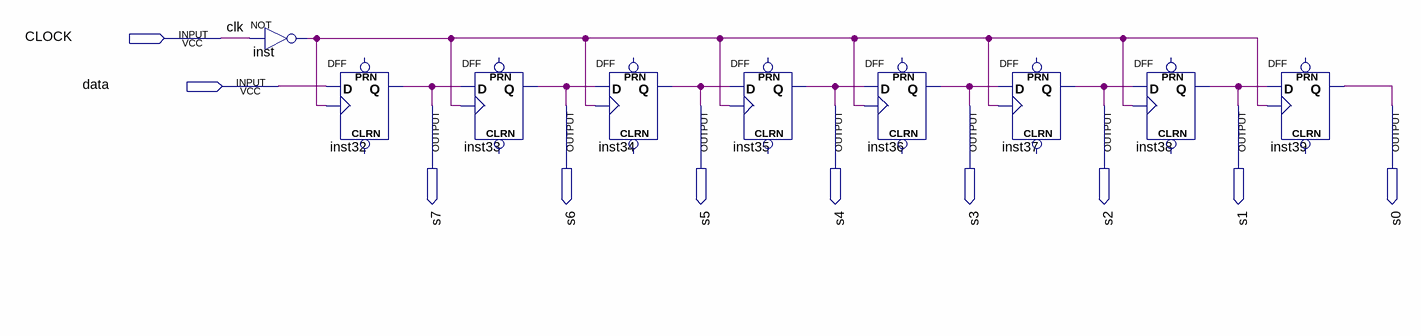
[diagram p0: schematic sheet]
// Quartus schematic reg_desl.bdf as structural Verilog: 9 symbols, 10 pins
module reg_desl (
  input  CLOCK,
  input  data,
  output s7,
  output s6,
  output s5,
  output s4,
  output s3,
  output s2,
  output s1,
  output s0
);

  wire inst_out;

  not inst (inst_out, CLOCK);
  DFF inst32 (.CLK(inst_out), .D(data), .Q(s7));  // open: CLRN, PRN
  DFF inst33 (.CLK(inst_out), .D(s7), .Q(s6));  // open: CLRN, PRN
  DFF inst34 (.CLK(inst_out), .D(s6), .Q(s5));  // open: CLRN, PRN
  DFF inst35 (.CLK(inst_out), .D(s5), .Q(s4));  // open: CLRN, PRN
  DFF inst36 (.CLK(inst_out), .D(s4), .Q(s3));  // open: CLRN, PRN
  DFF inst37 (.CLK(inst_out), .D(s3), .Q(s2));  // open: CLRN, PRN
  DFF inst38 (.CLK(inst_out), .D(s2), .Q(s1));  // open: CLRN, PRN
  DFF inst39 (.CLK(inst_out), .D(s1), .Q(s0));  // open: CLRN, PRN

  // Other names for the same wires on the sheet: clk = CLOCK
endmodule
